# EAGLE schematic ArduinoNano LearningBot 4-21-18 (EAGLE 8.4.1)
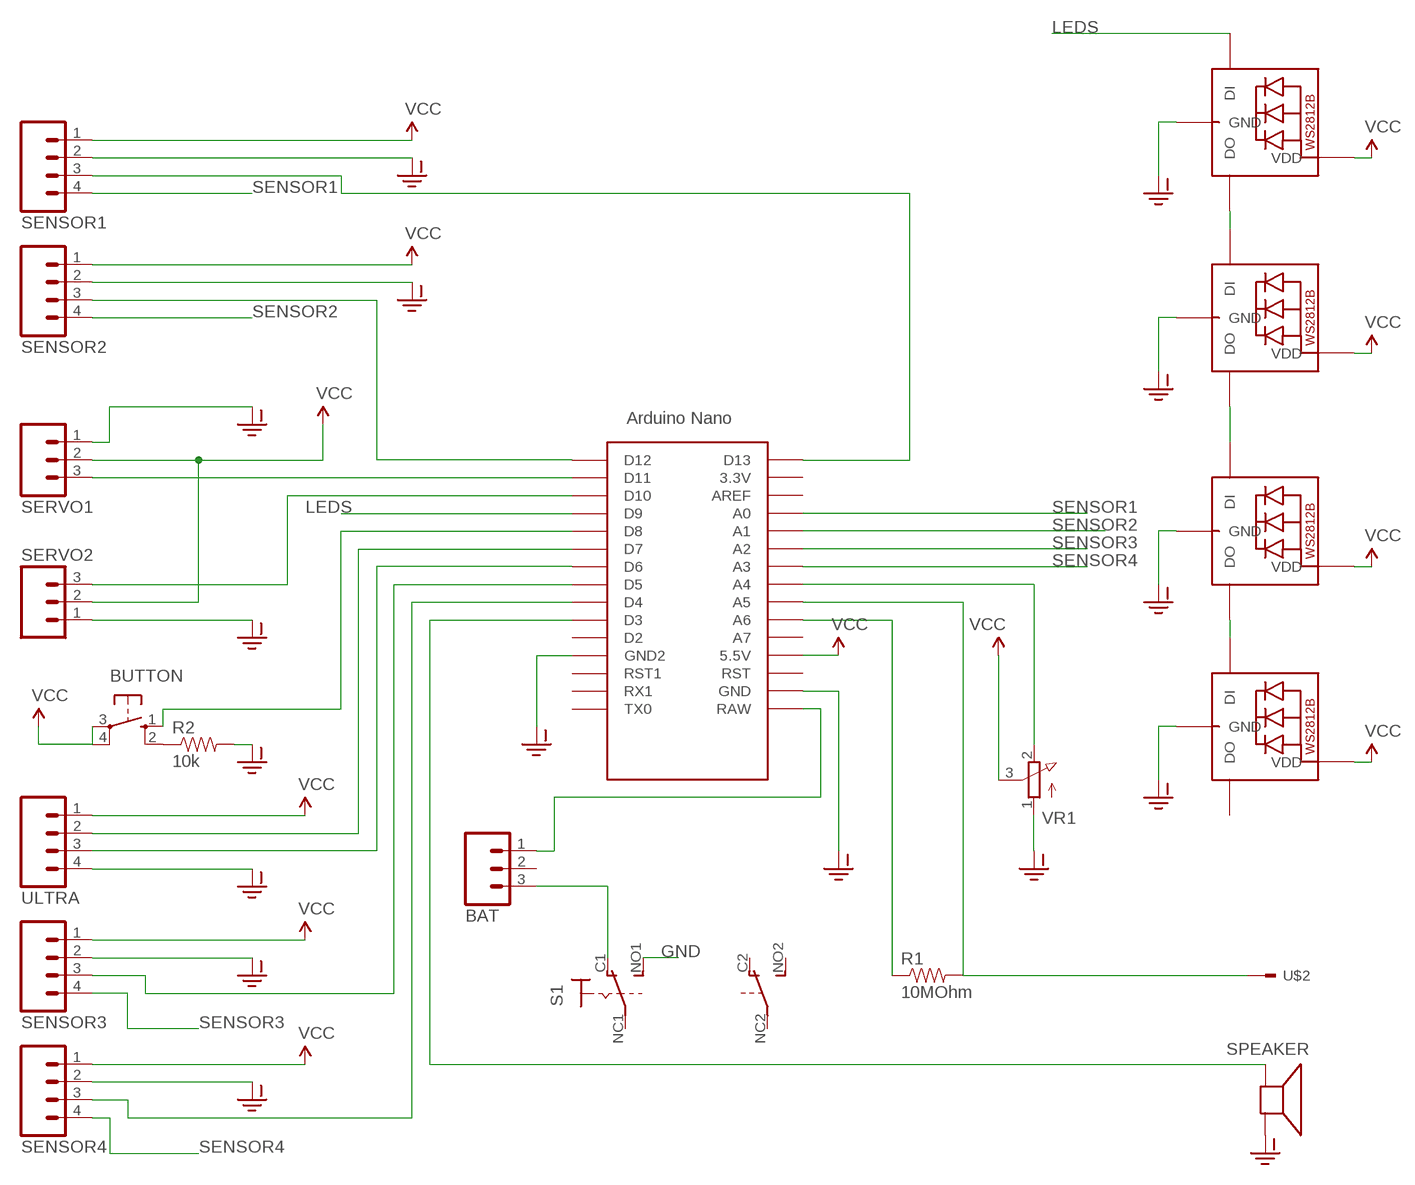
[diagram p0: schematic, sheet 1]

## Parts
BAT  M03POLAR  [MOLEX-1X3]
BUTTON  10-XX  [B3F-10XX]
LED1  WS2812B5050  [WS2812B]
LED2  WS2812B5050  [WS2812B]
LED3  WS2812B5050  [WS2812B]
LED4  WS2812B5050  [WS2812B]
R1  10MOhm  RESISTORPTH-1/4W  [AXIAL-0.4]
R2  10k  RESISTORPTH-1/4W  [AXIAL-0.4]
S1  SWITCH_320-938  [PS22F03]
SENSOR1  M04LOCK  [1X04_LOCK]
SENSOR2  M04LOCK  [1X04_LOCK]
SENSOR3  M04LOCK  [1X04_LOCK]
SENSOR4  M04LOCK  [1X04_LOCK]
SERVO1  M03LOCK  [1X03_LOCK]
SERVO2  M03LOCK  [1X03_LOCK]
SPEAKER  SPEAKER/AL60P  [AL60P]
U$1  ARDUINO-CLONE_NANO  [ARDUINO-CLONE_NANO]
U$2  TOUCHSENSOR  [TOUCH1]
ULTRA  M04LOCK  [1X04_LOCK]
VR1  3RP/1610N-VERTICAL  [3RP/1610N-VERTICAL]

## Nets
BUTTON: BUTTON.1(S) U$1.D8
CAP_TOUCH_RECEIVE_PIN: R1.P$1 U$1.A6
ECHO_PIN: U$1.D6 ULTRA.3
GND: LED1.3-GND(GND) LED2.3-GND(GND) LED3.3-GND(GND) LED4.3-GND(GND) R2.P$2 S1.NO1(1:S) SENSOR1.2 SENSOR2.2 SENSOR3.2 SENSOR4.2 SERVO1.1 SERVO2.1 SPEAKER.1(+) U$1.GND U$1.GND1(GND2) ULTRA.4 VR1.1(A) ; supply symbol labelled GND-ISO
IR_SENSOR1_DO: SENSOR2.3 U$1.D12
IR_SENSOR2_DO: SENSOR3.3 U$1.D5
LDR1_DO: SENSOR1.3 U$1.D13
LDR2_DO: SENSOR4.3 U$1.D4
LEDS: LED1.4-DIN(DI) U$1.D9
N$1: LED2.2-DOUT(DO)
N$2: LED3.4-DIN(DI)
N$3: BUTTON.2(S1) R2.P$1
N$4: LED3.2-DOUT(DO) LED4.4-DIN(DI)
N$5: LED1.2-DOUT(DO) LED2.4-DIN(DI)
N$6: SERVO1.3 U$1.D11
N$9: BAT.3 S1.C1(1:O)
POTPIN: U$1.A4 VR1.2(E)
RAWIN: BAT.1 U$1.RAW
SENSOR1: SENSOR1.4 U$1.A0
SENSOR2: SENSOR2.4 U$1.A1
SENSOR3: SENSOR3.4 U$1.A2
SENSOR4: SENSOR4.4 U$1.A3
SERVO2_PIN: SERVO2.3 U$1.D10
SPEAKERPIN: SPEAKER.2(-) U$1.D3
TOUCH: R1.P$2 U$1.A5 U$2.P$1
TRIG_PIN: U$1.D7 ULTRA.2
VCC: BUTTON.3(P) BUTTON.4(P1) LED1.1-VDD(VDD) LED2.1-VDD(VDD) LED3.1-VDD(VDD) LED4.1-VDD(VDD) SENSOR1.1 SENSOR2.1 SENSOR3.1 SENSOR4.1 SERVO1.2 SERVO2.2 U$1.5V(5.5V) ULTRA.1 VR1.3(S)
Unconnected: BAT.2 LED4.2-DOUT(DO) S1.C2(B:O) S1.NC1(1:P) S1.NC2(B:P) S1.NO2(B:S) U$1.3.3V U$1.A7 U$1.AREF U$1.D2 U$1.RST U$1.RST1 U$1.RX1 U$1.TX0

## Library data of the parts
BAT SERVO1 SERVO2 = SparkFun-Connectors:M03: Header 3 Standard 3-pin 0.1" header. Use with straight break away headers (SKU : PRT-00116), right angle break away headers (PRT-00553), swiss pins (PRT-00743), machine pins (PRT-00117), and female headers (PRT-00115). Molex polarized connector foot print use with SKU : PRT-08232 with associated crimp pins and housings.
BUTTON = switch-omron:10-XX: OMRON SWITCH; MPN: B3F-1000; OC_FARNELL: 176432; OC_NEWARK: 36M3542
LED1-LED4 = adafruit:WS2812B
R1 R2 = SparkFun-Passives:RESISTOR: Resistor Basic schematic elements and footprints for 0603, 1206, and PTH resistors.
S1 = ArduinoNano LearningBot 4-21-18:SWITCH_320-938: TOGGLE SWITCH distributor RS Components
SENSOR1-SENSOR4 ULTRA = SparkFun-Connectors:M04: Header 4 Standard 4-pin 0.1" header. Use with straight break away headers (SKU : PRT-00116), right angle break away headers (PRT-00553), swiss pins (PRT-00743), machine pins (PRT-00117), and female headers (PRT-00115). Molex polarized connector foot print use with SKU : PRT-08231 with associated crimp pins and housings. 1MM SMD Version SKU: PRT-10208; PROD_ID: CONN-09696
SPEAKER = adafruit:SPEAKER: SPEAKER Source: Buerklin Added PS12 (for part # PS1240 piezo) http://www.ladyada.net/library/pcb/eaglelibrary.html
U$1 = ArduinoNano LearningBot 3-15-18:ARDUINO-CLONE_NANO: Arduino Nano
U$2 = CapTouch:TOUCHSENSOR
VR1 = pot:3RP/1610N-VERTICAL: 16mm Potentiometer one level Source: http://www.alphapotentiometers.net/html/16mm_pot_2.html